# EAGLE design Dual Supply AC-DC (EAGLE 9.6.2)
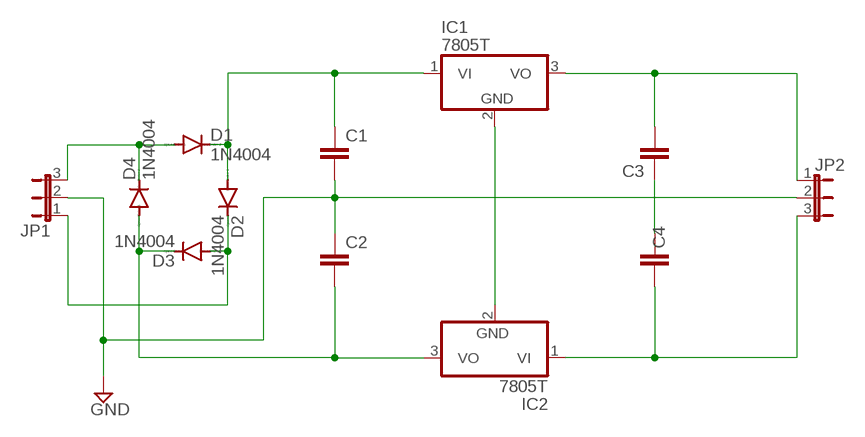
[diagram p0: schematic, sheet 1]

## Parts
C1  C2,5-3  [C2.5-3]
C2  C2,5-3  [C2.5-3]
C3  C2,5-3  [C2.5-3]
C4  C2,5-3  [C2.5-3]
D1  1N4004  [DO41-10]
D2  1N4004  [DO41-10]
D3  1N4004  [DO41-10]
D4  1N4004  [DO41-10]
IC1  7805T  [TO220H]
IC2  7805T  [TO220H]
JP1  JP2E  [JP2]
JP2  JP2E  [JP2]

## Nets
GND: C1.2 C2.1 JP1.2 JP2.2
N$1: D1.A D4.C JP1.3
N$2: C1.1 D1.C D2.A IC1.1(VI)
N$3: D2.C D3.A JP1.1
N$5: C3.2 IC1.3(VO) JP2.1
N$6: IC1.2(GND) IC2.2(GND)
N$7: C4.2 IC2.1(VI) JP2.3
N$8: C3.1 C4.1
N$10: C2.2 D3.C D4.A IC2.3(VO)

## Library data of the parts
C1-C4 = capacitor-wima:C: CAPACITOR naming: grid - package width
D1-D4 = diode:1N4004: DIODE general purpose rectifier, 1 A
IC1 IC2 = linear:78*: Positive VOLTAGE REGULATOR Source: http://cache.national.com/ds/LM/LM78L05.pdf http://www.fairchildsemi.com/ds/LM/LM7805.pdf
JP1 JP2 = jumper:JP2E: JUMPER

## Board
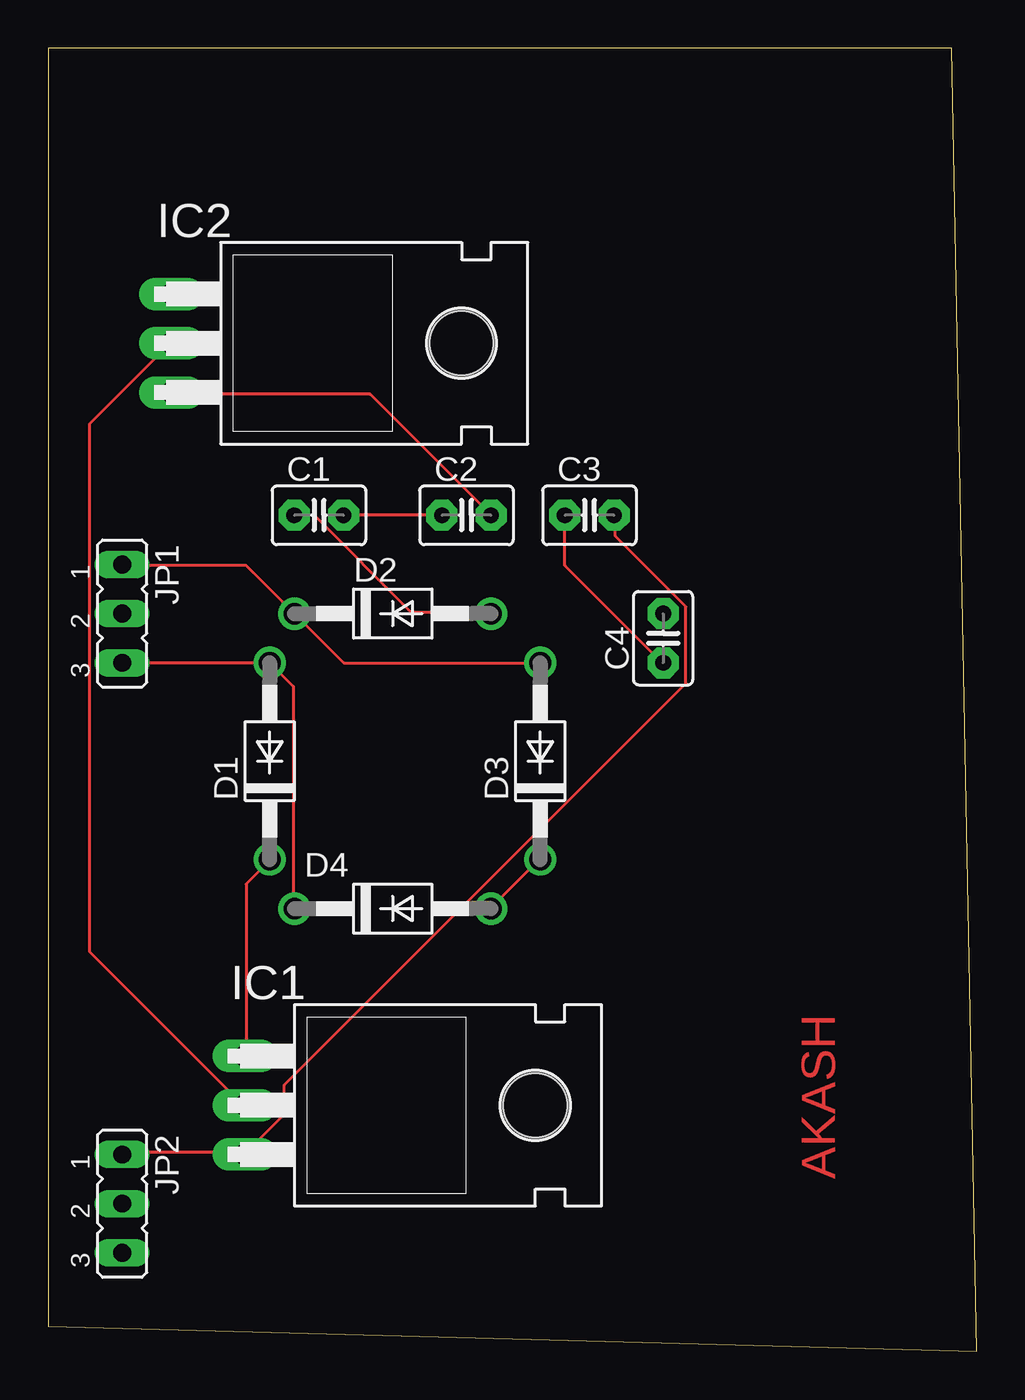
[diagram p1: board, top side]
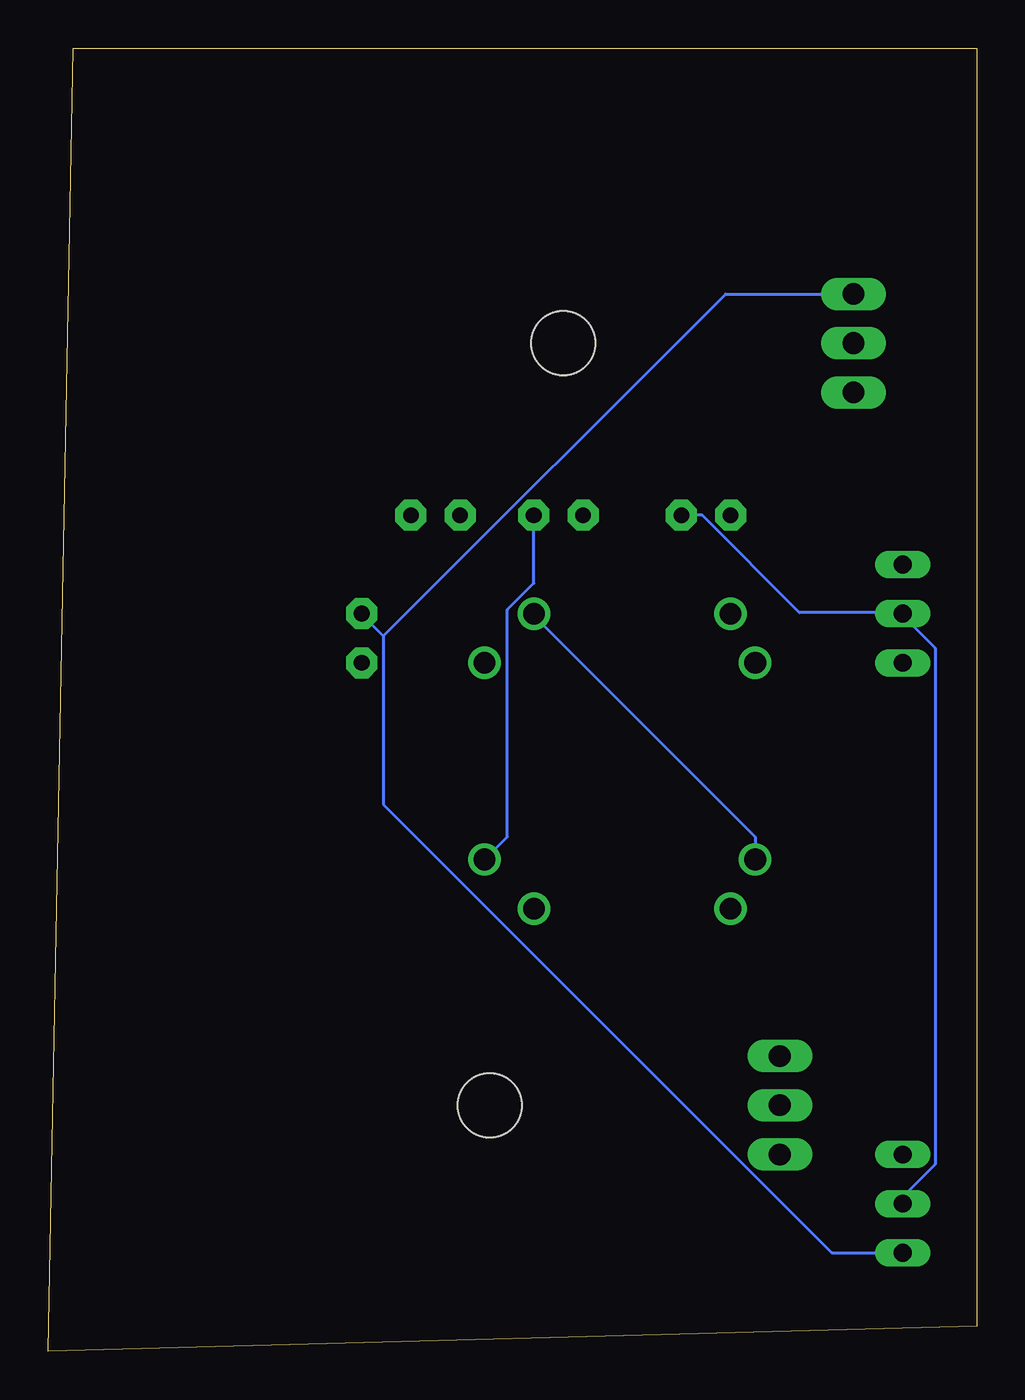
[diagram p2: board, bottom side, seen from below]

Size 47.93 x 67.3 mm. Coordinates in mm from the lower left corner, seen from the top.
Outline: 0,1.27 47.93,0 46.66,67.3 0,67.3 0,1.27
Copper layers (1*16): Top 0.035mm / dielectric 1.5mm / Bottom 0.035mm
Design rules "default": minimum track width 6mil, minimum drill 0.35mm, track to track 6mil, track to pad 6mil, pad to pad 6mil, via to via 6mil, smd to smd 6mil, copper to edge 40mil, drill to drill 6mil, minimum pad ring 10mil, minimum via ring 8mil, stop-mask expansion 4mil, vias tented up to drill 0mil, thermal gap 10mil

### Footprints (pad centres in the part's own frame; a part is rotated, then mirrored left to right if it is on the bottom)
C2.5-3 = drill 0.813 pad 1.6 octagon: 1 -1.27,0; 2 1.27,0
DO41-10 = drill 1.118: A 5.08,0; C -5.08,0
TO220H = drill 1.118 long: 1 -2.54,-10.16; 2 0,-10.16; 3 2.54,-10.16 | hole 3.302: 0,4.826
JP2 = drill 0.914 long: 1 -2.54,0; 2 0,0; 3 2.54,0

### Placement (x,y rotation side)
C1  13.97,43.18 0 top
C2  21.59,43.18 0 top
C3  27.94,43.18 0 top
C4  31.75,36.83 90 top
D1  11.43,30.48 90 top
D2  17.78,38.1 0 top
D3  25.4,30.48 90 top
D4  17.78,22.86 0 top
IC1  20.32,12.7 270 top
IC2  16.51,52.07 270 top
JP1  3.81,38.1 270 top
JP2  3.81,7.62 270 top

### Tracks (layer width: path | path; a pad name or v marks a point on that pad's centre or on a via)
GND
  Top 0.152: C2.1 C1.2
  Bottom 0.152: JP2.2 3.81,7.98 2.13,9.65 2.13,36.32 3.81,38 JP1.2 3.81,38.15 9.14,38.15 14.17,43.18 C1.2
N$1
  Top 0.152: JP1.3 D1.A 12.65,34.34 12.65,22.91 D4.C
N$2
  Top 0.152: IC1.1 10.21,15.29 10.21,24.13 11.43,25.35 D1.C | C1.1 13.72,43.18 18.75,38.15 22.86,38.15 D2.A
  Bottom 0.152: D1.C 11.43,26.57 22.86,38 D2.A
N$3
  Top 0.152: JP1.1 3.81,40.59 10.21,40.59 D2.C 15.24,35.56 D3.A
N$5
  Top 0.152: JP2.1 3.81,10.26 10.06,10.26 IC1.3 10.21,10.26 12.19,12.24 12.19,13.77 32.92,34.49 32.92,38.46 29.26,42.11 29.26,43.18 C3.2
N$6
  Top 0.152: IC2.2 6.25,52.02 2.13,47.9 2.13,20.62 10.06,12.7 IC1.2
N$7
  Bottom 0.152: JP2.3 7.47,5.08 30.63,28.25 30.63,36.93 | 30.63,36.93 31.7,38 C4.2 | IC2.1 12.95,54.61 30.63,36.93
N$8
  Top 0.152: C3.1 26.67,40.59 31.7,35.56 C4.1
N$10
  Top 0.152: D4.A 22.86,22.91 25.3,25.35 D3.C | C2.2 16.61,49.43 6.4,49.43 IC2.3
  Bottom 0.152: C2.2 22.86,39.68 24.23,38.3 24.23,26.57 D3.C

### Text on the board
Top: AKASH